# EAGLE design motobone1 (EAGLE 6.4)
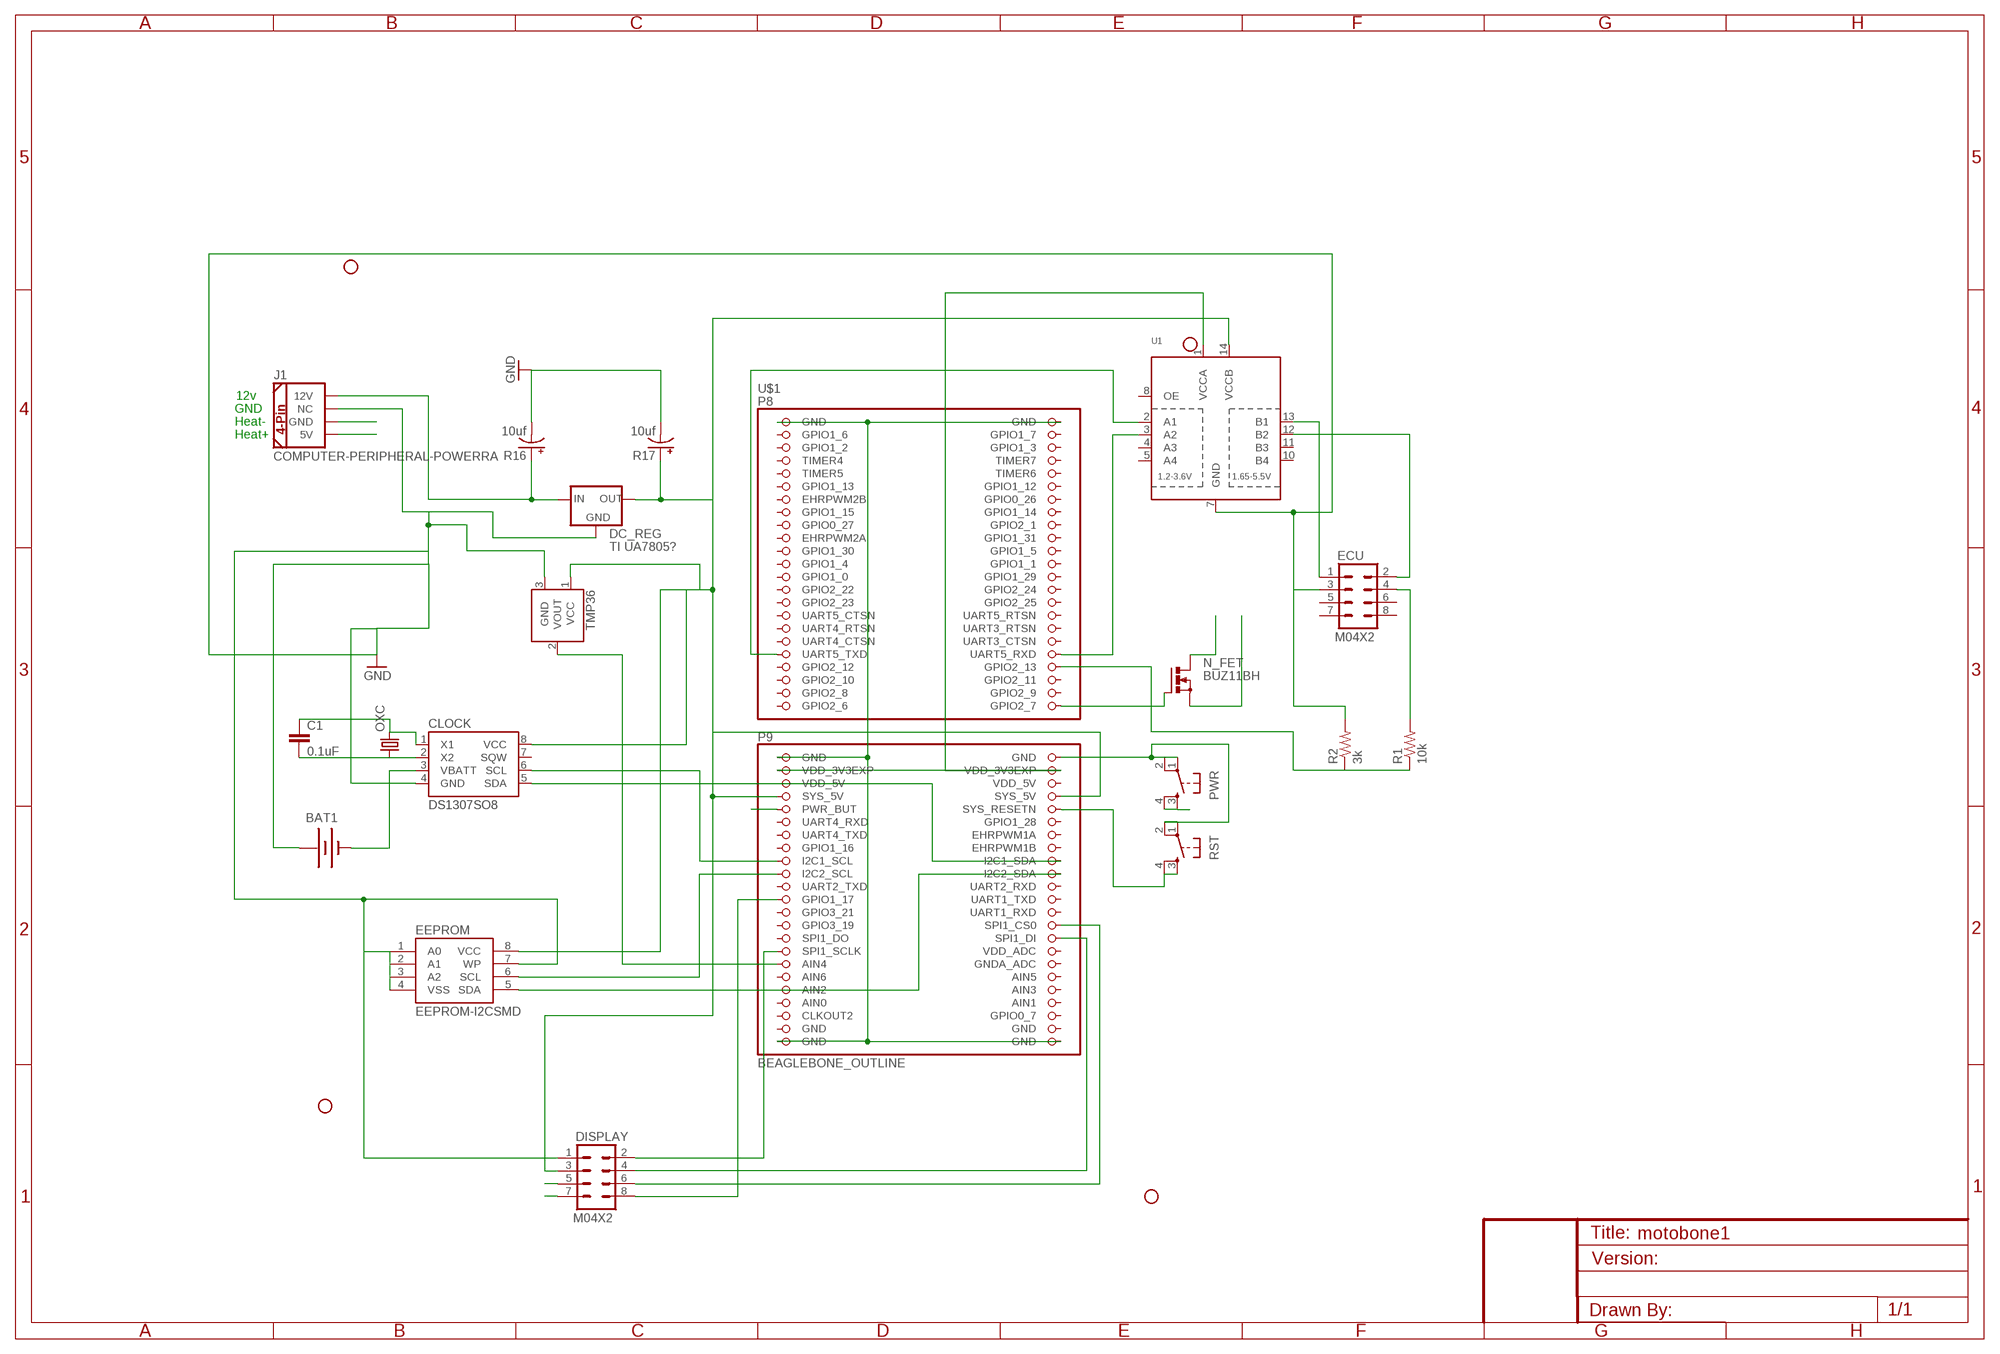
[diagram p0: schematic, sheet 1]

## Parts
BAT1  BATTERY12PTH  [BATTCON_12MM_PTH]
C1  0.1uF  10UF-6.3V-20%(1206)  [1206]
CLOCK  DS1307SO8  [SO08]
DC_REG  TI UA7805?  V_REG_78XXSIDE  [78XXL]
DISPLAY  M04X2  [2X4]
ECU  M04X2  [2X4]
EEPROM  EEPROM-I2CSMD  [SO08]
J1  COMPUTER-PERIPHERAL-POWERRA  [COMPUTER-PERIPHERAL-POWER-RA]
N_FET  BUZ11BH  [TO220BH]
OXC  CRYSTALTC38H  [TC38H]
PWR  TAC_SWITCHPTH  [TACTILE-PTH]
R1  10k  RESISTOR1206  [1206]
R2  3k  RESISTOR1206  [1206]
R16  10uf  10UF-TANT  [EIA3216]
R17  10uf  10UF-TANT  [EIA3216]
RST  TAC_SWITCHPTH  [TACTILE-PTH]
STANDOFF1  STAND-OFF  [STAND-OFF]
STANDOFF2  STAND-OFF  [STAND-OFF]
STANDOFF3  STAND-OFF  [STAND-OFF]
STANDOFF4  STAND-OFF  [STAND-OFF]
TMP36  TMP36GT9  [TO-92]
U1  TXB0104PWRSOIC14  [SO14]
U$1  BEAGLEBONE_OUTLINE  [BEAGLEBONE_SHIELD]

## Nets
12V [12v_power]: DC_REG.IN J1.12V R16.A(+)
12V_ECU: ECU.4 R1.2
GND [GND]: BAT1.VCC@1(+) CLOCK.4(GND) DC_REG.GND DISPLAY.1 ECU.3 EEPROM.1(A0) EEPROM.2(A1) EEPROM.3(A2) EEPROM.4(VSS) EEPROM.7(WP) J1.NC PWR.1 PWR.2 R2.2 R16.C(-) R17.C(-) RST.1 RST.2 TMP36.3(GND) U1.7(GND) U$1.48(GND)
HEAT+ [12v_power]: J1.5V N_FET.S
HEAT- [12v_power]: J1.GND N_FET.D
HEAT_GPIO: N_FET.G U$1.46(GPIO2_7)
N$1: DISPLAY.4 U$1.76(SPI1_DI)
N$2: CLOCK.6(SCL) U$1.63(I2C1_SCL)
N$3: DISPLAY.2 U$1.77(SPI1_SCLK)
N$4: TMP36.2(VOUT) U$1.79(AIN4)
N$5: C1.2 CLOCK.2(X2) OXC.1
N$6: C1.1 CLOCK.1(X1) OXC.2
N$7: CLOCK.5(SDA) U$1.64(I2C1_SDA)
N$8: BAT1.GND(-) CLOCK.3(VBATT)
N$9: EEPROM.6(SCL) U$1.65(I2C2_SCL)
N$10: EEPROM.5(SDA) U$1.66(I2C2_SDA)
N$11: DISPLAY.6 U$1.74(SPI1_CS0)
N$12: U$1.1(GND) U$1.2(GND) U$1.47(GND) U$1.91(GND) U$1.92(GND)
N$17: R1.1 R2.1 U$1.40(GPIO2_13)
N$22: DISPLAY.8 U$1.69(GPIO1_17)
N$23: ECU.1 U1.13(B1)
N$24: ECU.2 U1.12(B2)
N$25: U1.3(A2) U$1.38(UART5_RXD)
N$26: U1.2(A1) U$1.37(UART5_TXD)
PWR_BTN: DISPLAY.7 PWR.3 PWR.4 U$1.55(PWR_BUT)
RST_BTN: DISPLAY.5 RST.3 RST.4 U$1.56(SYS_RESETN)
SYS_5V [5v_power]: CLOCK.8(VCC) DC_REG.OUT DISPLAY.3 EEPROM.8(VCC) R17.A(+) TMP36.1(VCC) U1.14(VCCB) U$1.53(SYS_5V) U$1.54(SYS_5V)
VDD_3V3: U1.1(VCCA) U$1.49(VDD_3V3EXP) U$1.50(VDD_3V3EXP)
Unconnected: CLOCK.7(SQW) ECU.5 ECU.6 ECU.7 ECU.8 U1.4(A3) U1.5(A4) U1.8(OE) U1.10(B4) U1.11(B3) U$1.3(GPIO1_6) U$1.4(GPIO1_7) U$1.5(GPIO1_2) U$1.6(GPIO1_3) U$1.7(TIMER4) U$1.8(TIMER7) U$1.9(TIMER5) U$1.10(TIMER6) U$1.11(GPIO1_13) U$1.12(GPIO1_12) U$1.13(EHRPWM2B) U$1.14(GPIO0_26) U$1.15(GPIO1_15) U$1.16(GPIO1_14) U$1.17(GPIO0_27) U$1.18(GPIO2_1) U$1.19(EHRPWM2A) U$1.20(GPIO1_31) U$1.21(GPIO1_30) U$1.22(GPIO1_5) U$1.23(GPIO1_4) U$1.24(GPIO1_1) U$1.25(GPIO1_0) U$1.26(GPIO1_29) U$1.27(GPIO2_22) U$1.28(GPIO2_24) U$1.29(GPIO2_23) U$1.30(GPIO2_25) U$1.31(UART5_CTSN) U$1.32(UART5_RTSN) U$1.33(UART4_RTSN) U$1.34(UART3_RTSN) U$1.35(UART4_CTSN) U$1.36(UART3_CTSN) U$1.39(GPIO2_12) U$1.41(GPIO2_10) U$1.42(GPIO2_11) U$1.43(GPIO2_8) U$1.44(GPIO2_9) U$1.45(GPIO2_6) U$1.57(UART4_RXD) U$1.58(GPIO1_28) U$1.59(UART4_TXD) U$1.60(EHRPWM1A) U$1.61(GPIO1_16) U$1.62(EHRPWM1B) U$1.67(UART2_TXD) U$1.68(UART2_RXD) U$1.70(UART1_TXD) U$1.71(GPIO3_21) U$1.72(UART1_RXD) U$1.73(GPIO3_19) U$1.75(SPI1_DO) U$1.78(VDD_ADC) U$1.80(GNDA_ADC) U$1.81(AIN6) U$1.82(AIN5) U$1.83(AIN2) U$1.84(AIN3) U$1.86(AIN1) U$1.87(CLKOUT2) U$1.88(GPIO0_7)

## Notes on the sheet
- 12v
- GND
- Heat-
- Heat+

## Power pins joined to a net without a drawn wire
AIN0: U$1.85(AIN0)
GND: U$1.89(GND) U$1.90(GND)
VDD_5V: U$1.51(VDD_5V) U$1.52(VDD_5V)

## Library data of the parts
BAT1 = SparkFun-Electromechanical:BATTERY: Battery Holders Various common sizes : AA, AAA, 20mm coin cell and 12mm coin cell. 20MM_4LEGS, BATT-10373
C1 = SparkFun-Capacitors:10UF-6.3V-20%(1206): Ceramic CAP-10057; PROD_ID: CAP-10057; VALUE: 10uF
CLOCK = SparkFun-FreqCtrl:DS1307: I2C real-time clock with battery backup.
DC_REG = SparkFun-PowerIC:V_REG_78XX: Voltage Regulator Standard 7805 5V regulator. IGO (Input Ground Output). Spark Fun Electronics SKU : COM-00107
DISPLAY ECU = SparkFun-Connectors:M04X2: .1" header, two rows of four.
EEPROM = SparkFun-DigitalIC:EEPROM-I2C: I2C EEPROM chips, 24LC256 (and others)
J1 = SparkFun-Connectors:COMPUTER-PERIPHERAL-POWER
N_FET = transistor-power:BUZ11: N-CHANNEL MOS FET
OXC = crystal:CRYSTAL: CRYSTAL; OC_FARNELL: unknown; OC_NEWARK: unknown
PWR RST = SparkFun-Electromechanical:TAC_SWITCH: Momentary Switch Button commonly used for reset or general input. Spark Fun Electronics SKU : COM-00097 SMT- SWCH-08247
R1 R2 = SparkFun-Resistors:RESISTOR: Resistor Basic schematic elements and footprints for 0603, 1206, and PTH resistors.
R16 R17 = SparkFun-Capacitors:10UF-TANT: 10uF Tantalum SMT CAP-00811- 16V 10% (EIA-3216); PROD_ID: CAP-00811; VALUE: 10uF
STANDOFF1-STANDOFF4 = SparkFun-Electromechanical:STAND-OFF: #4 Stand Off This is the mechanical footprint for a #4 phillips button head screw. Use the keepout ring to avoid running the screw head into surrounding components. SKU : PRT-00447
TMP36 = SparkFun-Sensors:TMP36: Precision degC temp sensor, analog out
U1 = SparkFun-DigitalIC:TXB0104PWR: 4-Bit Bi-Directional Level Shifter 1.2V-3.6V (VCCA) to 1.65V-5.5V (VCCB) bi-directional level shifter with auto direction sensing. Max data rate - VCCA 1.8V: 20Mbps (50ns), VCCA 3.3V: 100Mbps (10ns) Digikey: 296-21929-1-ND
U$1 = adafruit:BEAGLEBONE_OUTLINE: Should match A3 pinout - but not completely tested

## Net classes
0 default: width 0.254 mm
1 12v_power: width 1.524 mm, clearance 0.254 mm
2 5v_power: width 0.762 mm, clearance 0.127 mm
3 GND: width 0.762 mm, clearance 0.127 mm

## Board
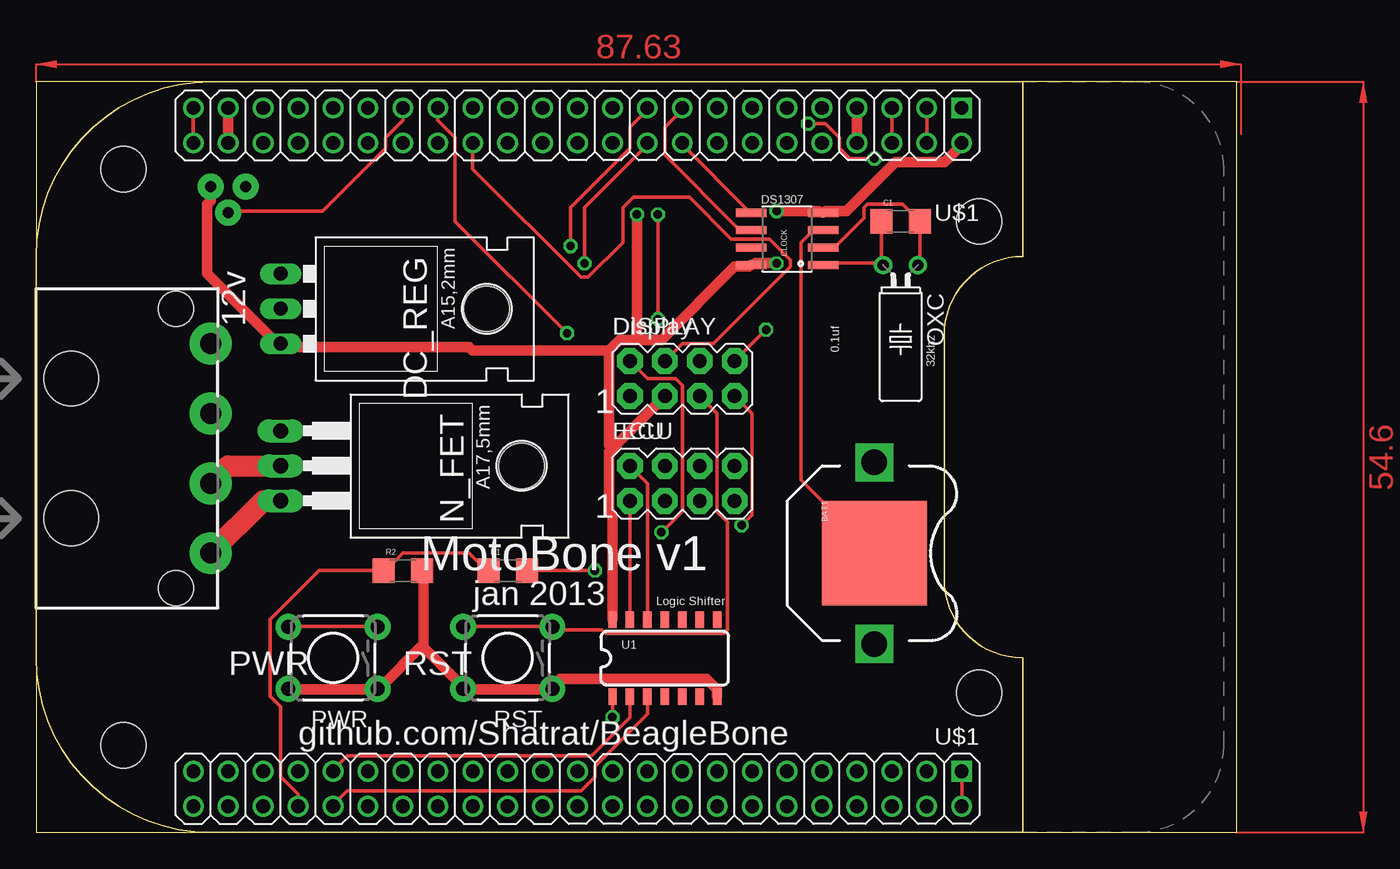
[diagram p1: board, top side]
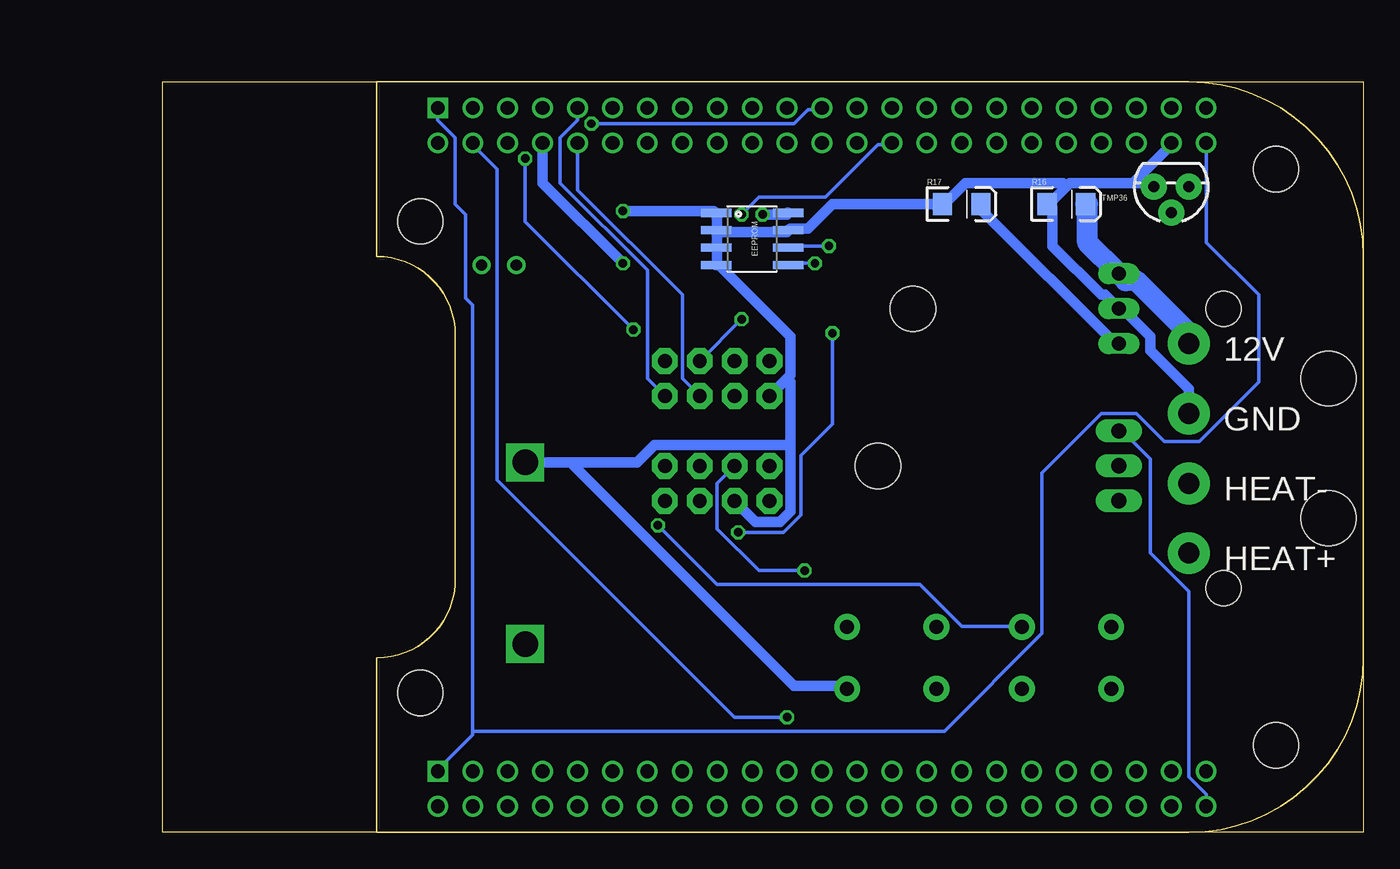
[diagram p2: board, bottom side, seen from below]

Size 87.3 x 54.61 mm. Coordinates in mm from the lower left corner, seen from the top.
Outline: 0,0 87.3,0 87.3,54.6 0,54.6 0,0
Copper layers (1*16): Top 0.035mm / dielectric 1.5mm / Bottom 0.035mm
Design rules "default": minimum track width 10mil, minimum drill 24mil, track to track 8mil, track to pad 8mil, pad to pad 8mil, via to via 8mil, smd to smd 8mil, copper to edge 40mil, drill to drill 8mil, minimum pad ring 10mil, minimum via ring 8mil, stop-mask expansion 4mil, vias tented up to drill 0mil, thermal gap 10mil

### Footprints (pad centres in the part's own frame; a part is rotated, then mirrored left to right if it is on the bottom)
BATTCON_12MM_PTH = smd 7.62 x 7.62: GND 0,0 | drill 1.854 square: VCC@1 -6.604,0; VCC@2 6.604,0
1206 = smd 1.6 x 1.8: 1 -1.4,0; 2 1.4,0
SO08 = smd 0.61 x 2.21: 1 -1.905,-2.616; 2 -0.635,-2.616; 3 0.635,-2.616; 4 1.905,-2.616; 5 1.905,2.616; 6 0.635,2.616; 7 -0.635,2.616; 8 -1.905,2.616
78XXL = drill 1.016 long: GND 0,-3.81; IN -2.54,-3.81; OUT 2.54,-3.81 | hole 3.302: 0,11.176
2X4 = drill 1.016 pad 1.88 octagon: 1 -3.81,-1.27; 2 -3.81,1.27; 3 -1.27,-1.27; 4 -1.27,1.27; 5 1.27,-1.27; 6 1.27,1.27; 7 3.81,-1.27; 8 3.81,1.27
COMPUTER-PERIPHERAL-POWER-RA = drill 1.524 pad 3.048: 5V -7.62,-2.54; 12V 7.62,-2.54; GND -2.54,-2.54; NC 2.54,-2.54 | hole 2.54: -10.16,0; 10.16,0 | hole 3.988: -5.08,7.62; 5.08,7.62
TO220BH = drill 1.118 long: D 0,-6.35; G -2.54,-6.35; S 2.54,-6.35 | hole 3.302: 0,11.176
TC38H = drill 0.813: 1 -1.27,0; 2 1.27,0
TACTILE-PTH = drill 1.016 pad 1.88: 1 -3.251,2.261; 2 3.251,2.261; 3 -3.251,-2.261; 4 3.251,-2.261
EIA3216 = smd 1.4 x 1.6: A 1.4,0; C -1.4,0
STAND-OFF = hole 3.302: 0,0
TO-92 = drill 0.813 pad 1.88: 1 -1.27,0; 2 0,1.905; 3 1.27,0
SO14 = smd 0.6 x 1.2: 1 -3.81,-2.8; 2 -2.54,-2.8; 3 -1.27,-2.8; 4 0,-2.8; 5 1.27,-2.8; 6 2.54,-2.8; 7 3.81,-2.8; 8 3.81,2.8; 9 2.54,2.8; 10 1.27,2.8; 11 0,2.8; 12 -1.27,2.8; 13 -2.54,2.8; 14 -3.81,2.8
BEAGLEBONE_SHIELD = drill 1 square: 1 4.445,19.05; 47 52.705,19.05 | drill 1: 2 1.905,19.05; 3 4.445,21.59; 4 1.905,21.59; 5 4.445,24.13; 6 1.905,24.13; 7 4.445,26.67; 8 1.905,26.67; 9 4.445,29.21; 10 1.905,29.21; 11 4.445,31.75; 12 1.905,31.75; 13 4.445,34.29; 14 1.905,34.29; 15 4.445,36.83; 16 1.905,36.83; 17 4.445,39.37; 18 1.905,39.37; 19 4.445,41.91; 20 1.905,41.91; 21 4.445,44.45; 22 1.905,44.45; 23 4.445,46.99; 24 1.905,46.99; 25 4.445,49.53; 26 1.905,49.53; 27 4.445,52.07; 28 1.905,52.07; 29 4.445,54.61; 30 1.905,54.61; 31 4.445,57.15; 32 1.905,57.15; 33 4.445,59.69; 34 1.905,59.69; 35 4.445,62.23; 36 1.905,62.23; 37 4.445,64.77; 38 1.905,64.77; 39 4.445,67.31; 40 1.905,67.31; 41 4.445,69.85; 42 1.905,69.85; 43 4.445,72.39; 44 1.905,72.39; 45 4.445,74.93; 46 1.905,74.93; 48 50.165,19.05; 49 52.705,21.59; 50 50.165,21.59; 51 52.705,24.13; 52 50.165,24.13; 53 52.705,26.67; 54 50.165,26.67; 55 52.705,29.21; 56 50.165,29.21; 57 52.705,31.75; 58 50.165,31.75; 59 52.705,34.29; 60 50.165,34.29; 61 52.705,36.83; 62 50.165,36.83; 63 52.705,39.37; 64 50.165,39.37; 65 52.705,41.91; 66 50.165,41.91; 67 52.705,44.45; 68 50.165,44.45; 69 52.705,46.99; 70 50.165,46.99; 71 52.705,49.53; 72 50.165,49.53; 73 52.705,52.07; 74 50.165,52.07; 75 52.705,54.61; 76 50.165,54.61; 77 52.705,57.15; 78 50.165,57.15; 79 52.705,59.69; 80 50.165,59.69; 81 52.705,62.23; 82 50.165,62.23; 83 52.705,64.77; 84 50.165,64.77; 85 52.705,67.31; 86 50.165,67.31; 87 52.705,69.85; 88 50.165,69.85; 89 52.705,72.39; 90 50.165,72.39; 91 52.705,74.93; 92 50.165,74.93

### Placement (x,y rotation side)
BAT1  60.96,20.32 270 top
C1  62.87,44.45 0 top
CLOCK  54.61,43.18 90 top
DC_REG  21.59,38.1 270 top
DISPLAY  46.99,33.02 0 top
ECU  46.99,25.4 0 top
EEPROM  44.45,43.18 270 bottom
J1  10.16,27.94 90 top
N_FET  24.13,26.67 270 top
OXC  62.87,41.27 180 top
PWR  21.59,12.7 180 top
R1  34.29,19.05 0 top
R2  26.67,19.05 0 top
R16  21.59,45.72 0 bottom
R17  29.21,45.72 0 bottom
RST  34.29,12.7 180 top
STANDOFF1  6.35,48.26 0 top
STANDOFF2  68.58,10.16 0 top
STANDOFF3  68.58,44.45 0 top
STANDOFF4  6.35,6.35 0 top
TMP36  13.97,46.99 180 bottom
U1  45.72,12.7 0 top
U$1  86.36,0 90 top

### Tracks (layer width: path | path; a pad name or v marks a point on that pad's centre or on a via)
12V
  Bottom 1.524: R16.A 20.07,45.72 20.07,42.93 DC_REG.IN 17.27,40.13 16.51,40.13 12.7,36.32 J1.12V
12V_ECU  (via drill 0.61)
  Top 0.254: v40.64,19.05 R1.2
  Bottom 0.254: v40.64,19.05 43.94,19.05 46.99,22.1 46.99,25.4 ECU.4
GND  (via drill 0.61)
  Top 0.762: U$1.89 U$1.90 | U1.7 49.53,10.41 48.77,11.18 38.1,11.18 37.59,10.67 RST.1 37.34,10.41 31.24,10.41 RST.2 30.99,10.67 28.19,13.46 | PWR.2 18.54,10.41 24.64,10.41 PWR.1 25.15,10.67 27.94,13.46 28.19,13.46 | 28.19,13.46 28.19,19.05 R2.2 | U$1.48 67.31,50.04 66.04,48.77 62.48,48.77 58.93,45.21 57.4,45.21 CLOCK.4 56.9,45.21 v53.85,45.21
  Bottom 0.762: 21.59,46.99 21.34,47.24 16.51,47.24 | 21.59,46.99 22.86,45.72 R16.C 22.61,45.47 22.61,42.67 19.05,39.12 18.8,39.12 DC_REG.GND 17.53,38.1 15.49,36.07 15.49,35.05 12.7,32.26 J1.NC | 16.51,47.24 15.49,47.24 TMP36.3 | 21.59,46.99 21.84,47.24 28.96,47.24 30.48,45.72 R17.C 38.61,45.72 40.39,43.94 41.66,43.94 EEPROM.7 41.91,43.69 46.99,43.69 | U$1.90 13.97,50.04 16.51,47.5 16.51,47.24 | 46.99,43.69 EEPROM.2 46.99,43.94 46.99,44.96 EEPROM.1 47.24,45.21 v53.85,45.21 | 46.99,43.69 46.99,42.67 EEPROM.3 46.99,42.42 46.99,41.4 EEPROM.4 46.74,41.15 41.66,36.07 41.66,33.27 41.91,33.02 | 41.91,33.02 DISPLAY.1 | ECU.3 44.2,22.61 42.42,22.61 41.66,23.37 41.66,28.19 | 41.66,28.19 41.66,32.77 41.91,33.02 | 57.4,26.92 52.83,26.92 51.56,28.19 41.66,28.19 | 57.4,26.92 BAT1.VCC@1 | RST.1 37.59,10.67 41.4,10.67 57.4,26.67 57.4,26.92
HEAT+
  Top 1.524: N_FET.S 16.51,24.13 J1.5V
HEAT-
  Top 1.524: N_FET.D 13.97,26.67 J1.GND
HEAT_GPIO
  Bottom 0.254: U$1.46 11.43,2.79 12.7,4.06 12.7,17.53 15.49,20.32 15.49,27.18 17.53,29.21 N_FET.G
N$1
  Top 0.254: U$1.76 31.75,48.26 39.62,40.39 40.13,40.39 42.67,42.93 42.67,45.47 43.43,46.23 47.5,46.23 50.55,43.18 53.34,43.18 54.86,41.66 54.86,41.15 49.28,35.56 46.99,35.56 DISPLAY.4
N$2
  Top 0.254: CLOCK.6 51.82,43.94 51.05,43.94 45.72,49.28 45.72,51.31 46.99,52.58 U$1.63
N$3  (via drill 0.61)
  Top 0.254: U$1.77 29.21,51.82 30.48,50.55 30.48,44.45 v38.61,36.32 | v45.47,21.84 46.99,23.37 46.99,32.51 46.48,33.02 44.45,33.02 DISPLAY.2
  Bottom 0.254: v38.61,36.32 38.61,29.72 40.89,27.43 40.89,23.11 42.16,21.84 v45.47,21.84
N$4
  Top 0.254: U$1.79 26.67,51.82 25.4,50.55 25.4,49.78 20.83,45.21 13.97,45.21 TMP36.2
N$5
  Top 0.254: C1.2 64.26,41.4 OXC.1 | C1.2 62.99,45.72 60.45,45.72 60.2,45.47 60.2,44.7 58.17,42.67 57.4,42.67 CLOCK.2 | C1.2
N$6
  Top 0.254: 61.47,41.4 C1.1 | 61.47,41.4 57.4,41.4 CLOCK.1 | 61.47,41.4 OXC.2
N$7
  Top 0.254: CLOCK.5 51.82,45.21 46.99,50.04 U$1.64
N$8
  Top 0.254: BAT1.GND 55.63,25.65 55.63,42.93 56.39,43.69 57.15,43.69 CLOCK.3
N$9  (via drill 0.61)
  Top 0.254: v38.86,42.67 38.86,45.47 43.18,49.78 43.18,51.31 44.45,52.58 U$1.65
  Bottom 0.254: v38.86,42.67 41.66,42.67 EEPROM.6
N$10  (via drill 0.61)
  Top 0.254: v39.88,41.4 39.88,45.47 44.45,50.04 U$1.66
  Bottom 0.254: v39.88,41.4 41.66,41.4 EEPROM.5
N$11  (via drill 0.61)
  Top 0.254: v45.21,37.34 v45.21,44.96
  Bottom 0.254: v45.21,44.96 43.94,46.23 39.12,46.23 35.31,50.04 34.29,50.04 U$1.74 | DISPLAY.6 v45.21,37.34
N$12
  Top 0.254: U$1.91 U$1.92 | U$1.1 U$1.2
  Bottom 0.254: U$1.47 67.31,51.82 66.04,50.55 66.04,45.72 65.28,44.96 65.28,38.86 64.77,38.35 64.77,7.37 | 64.77,7.37 64.77,7.11 67.31,4.57 U$1.1 | U$1.92 11.43,42.93 7.62,39.12 7.62,32.77 11.94,28.45 14.48,28.45 16.51,30.48 19.05,30.48 23.37,26.16 23.37,14.48 30.48,7.37 64.77,7.37
N$17
  Top 0.254: R1.1 32.77,19.05 31.5,20.32 26.67,20.32 25.4,19.05 R2.1 20.57,19.05 17.02,15.49 17.02,9.91 17.78,9.14 17.78,4.06 19.05,2.79 U$1.40
N$22  (via drill 0.61)
  Top 0.254: v56.13,51.56 57.4,51.56 58.42,50.55 58.42,49.78 59.18,49.02 v60.96,49.02 | DISPLAY.8 v53.09,36.58
  Bottom 0.254: v56.13,51.56 41.4,51.56 40.39,52.58 39.37,52.58 U$1.69 | v60.96,49.02 60.96,44.45 v53.09,36.58
N$23
  Top 0.254: ECU.1 U1.13
N$24
  Top 0.254: U1.12 44.45,25.4 ECU.2
N$25
  Top 0.254: U1.3 44.45,8.64 40.64,4.83 40.64,4.06 39.62,3.05 22.61,3.05 21.59,2.03 U$1.38
N$26
  Top 0.254: U1.2 43.18,8.38 40.39,5.59 22.61,5.59 21.59,4.57 U$1.37
PWR_BTN  (via drill 0.61)
  Top 0.254: PWR.4 18.54,14.99 24.64,14.99 PWR.3 | v51.31,22.35 52.07,23.11 52.07,30.48 DISPLAY.7
  Bottom 0.254: U$1.55 57.15,51.82 58.42,50.55 58.42,47.24 52.07,40.89 52.07,33.02 DISPLAY.7 | v51.31,22.35 46.99,18.03 32.26,18.03 29.21,14.99 24.89,14.99 PWR.3
RST_BTN
  Top 0.254: RST.4 31.24,14.99 37.34,14.99 RST.3 37.59,14.73 41.15,14.73 41.4,14.48 50.04,14.48 50.29,14.73 50.29,22.61 49.53,23.37 49.53,30.48 DISPLAY.5
  Bottom 0.254: U$1.56 57.15,46.74 49.53,39.12 49.53,33.02 DISPLAY.5
SYS_5V  (via drill 0.61)
  Top 0.762: TMP36.1 12.7,45.97 12.45,45.72 12.45,40.64 17.53,35.56 DC_REG.OUT 18.03,35.31 31.5,35.31 31.75,35.05 41.66,35.05 | U$1.53 U$1.54 | U1.14 41.91,23.11 41.66,23.37 41.66,27.69 41.91,27.94 | DISPLAY.3 41.91,27.94 | 43.69,35.81 42.42,35.81 41.66,35.05 | 43.69,35.81 45.47,35.81 50.8,41.15 51.82,41.15 CLOCK.8 52.32,41.4 v53.85,41.4 | 41.66,35.05 41.66,28.19 41.91,27.94 | 43.69,35.81 v43.69,44.96
  Bottom 0.762: DC_REG.OUT 18.03,35.56 27.69,45.21 27.69,45.72 R17.A | v43.69,44.96 41.91,44.96 EEPROM.8 | U$1.54 59.69,47.24 v53.85,41.4
VDD_3V3  (via drill 0.61)
  Top 0.254: v41.91,8.38 U1.1 | U$1.50 U$1.49
  Bottom 0.254: v41.91,8.38 45.72,8.38 62.99,25.65 62.99,48.26 64.77,50.04 U$1.50
VDD_5V
  Top 0.254: U$1.51 U$1.52
(copper drawn outside any net)
  shapes: Top area x2

### Text on the board
tPlace: DS1307 | 12v | Display | 32khz | 0.1uf | 1 | ECU | 1 | MotoBone v1 | jan 2013 | Logic Shifter | PWR | RST | github.com/Shatrat/BeagleBone
bPlace: 12V | GND | HEAT- | HEAT+